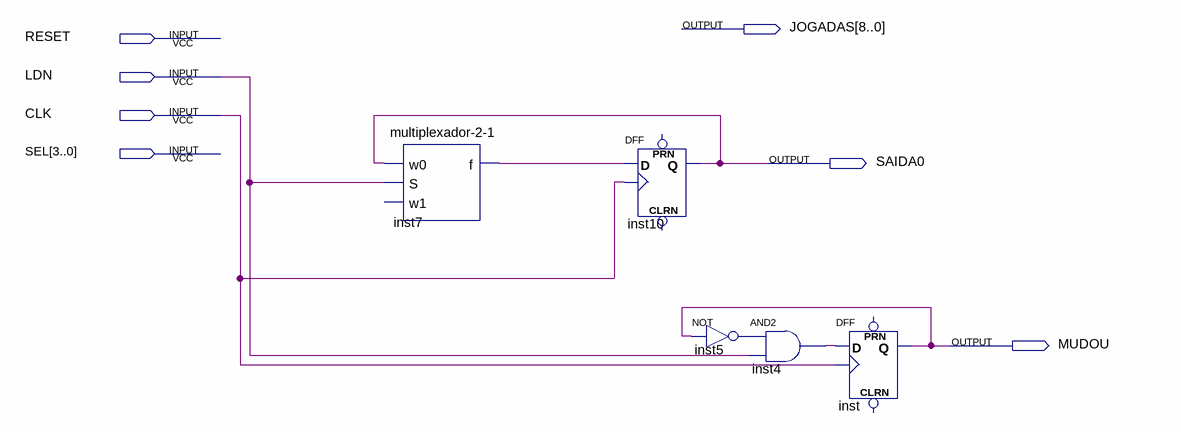
[diagram p0: schematic sheet]
// Quartus schematic prototipo_inicial_memoria.bdf as structural Verilog: 5 symbols, 7 pins
module prototipo_inicial_memoria (
  input  RESET,
  input  LDN,
  input  CLK,
  input  [3:0] SEL,
  output [8:0] JOGADAS,
  output SAIDA0,
  output MUDOU
);

  wire inst4_out, inst5_out, inst7_f;

  \multiplexador-2-1  inst7 (.w0(SAIDA0), .S(LDN), .f(inst7_f));  // open: w1
  DFF inst10 (.CLK(CLK), .D(inst7_f), .Q(SAIDA0));  // open: CLRN, PRN
  not inst5 (inst5_out, MUDOU);
  and inst4 (inst4_out, inst5_out, LDN);
  DFF inst (.CLK(CLK), .D(inst4_out), .Q(MUDOU));  // open: CLRN, PRN
endmodule
